# Altium schematic sheet PROC054D_System_LED.SchDoc: SYSTEM_LED
size 558 x 431 mm; Date: Not shown in title block; ApprovedBy: Not shown in title block; CheckedBy: Not shown in title block; Author: Not shown in title block; CompanyName: Not shown in title block; DrawnBy: a0271760; Engineer: Not shown in title block; Organization: Not shown in title block; Address1: Not shown in title block; Address2: Not shown in title block; Address3: Not shown in title block; Address4: Not shown in title block; DocumentNumber: 17; Revision: Use project pAWRameter SCH_Rev; SheetNumber: 17; SheetTotal: 19; PageSetup: Record=PageOptions|CenterHorizontal=True|CenterVertical=True|PrintScale=1.00|XCorrection=1.00|YCorrection=1.00|PrintKind=0|BorderSize=5000000|LeftOffset=0|BottomOffset=0|Orientation=2|PaperLength=1000|PaperWidth=1000|Scale=100|PaperSource=15|PrintQuality=600|MediaType=1|DitherType=10|PaperKind=Letter|PrintScaleMode=1; CurrentTime: Not shown in title block; CurrentDate: Not shown in title block; Time: Not shown in title block; DocumentFullPathAndName: Not shown in title block; DocumentName: Not shown in title block; ModifiedDate: Not shown in title block; ImagePath: Not shown in title block
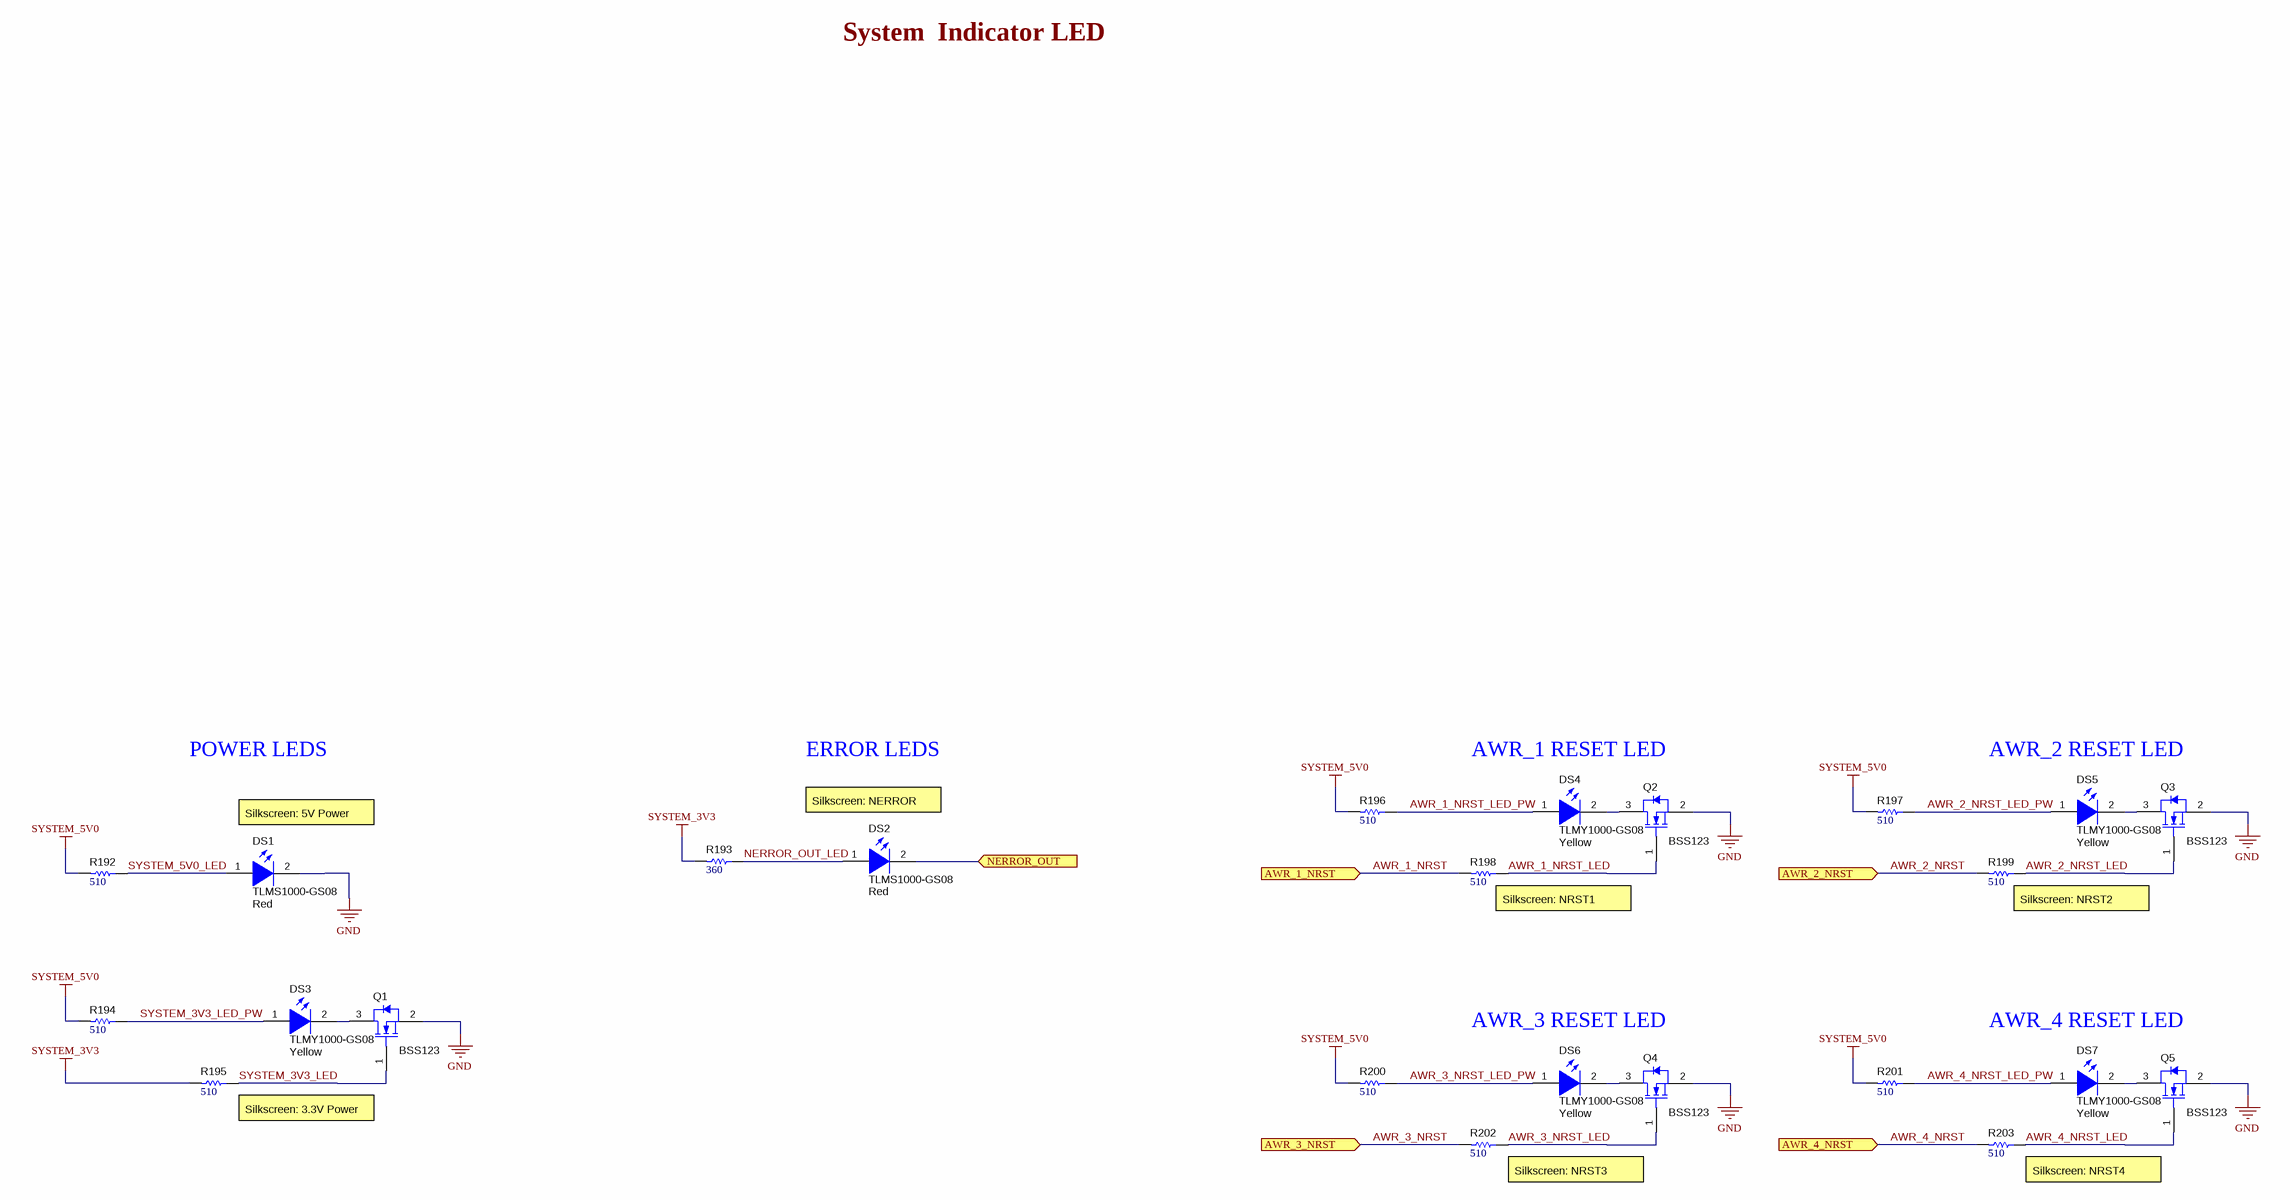
[diagram p0: PROC054D_System_LED.SchDoc]

## Parts
DS1  TLMS1000-GS08  value Red  [TLMx1000_Red]
DS2  TLMS1000-GS08  value Red  [TLMx1000_Red]
DS3  TLMY1000-GS08  value Yellow  [TLMx1000_Yellow]
DS4  TLMY1000-GS08  value Yellow  [TLMx1000_Yellow]
DS5  TLMY1000-GS08  value Yellow  [TLMx1000_Yellow]
DS6  TLMY1000-GS08  value Yellow  [TLMx1000_Yellow]
DS7  TLMY1000-GS08  value Yellow  [TLMx1000_Yellow]
Q1  BSS123  [SOT-23]
Q2  BSS123  [SOT-23]
Q3  BSS123  [SOT-23]
Q4  BSS123  [SOT-23]
Q5  BSS123  [SOT-23]
R192  ValueDisplayed: 510  [0402]  (hidden comment: ERJ-2GEJ511X)
R193  ValueDisplayed: 360  [0402]  (hidden comment: ERJ-2GEJ361X)
R194  ValueDisplayed: 510  [0402]  (hidden comment: ERJ-2GEJ511X)
R195  ValueDisplayed: 510  [0402]  (hidden comment: ERJ-2GEJ511X)
R196  ValueDisplayed: 510  [0402]  (hidden comment: ERJ-2GEJ511X)
R197  ValueDisplayed: 510  [0402]  (hidden comment: ERJ-2GEJ511X)
R198  ValueDisplayed: 510  [0402]  (hidden comment: ERJ-2GEJ511X)
R199  ValueDisplayed: 510  [0402]  (hidden comment: ERJ-2GEJ511X)
R200  ValueDisplayed: 510  [0402]  (hidden comment: ERJ-2GEJ511X)
R201  ValueDisplayed: 510  [0402]  (hidden comment: ERJ-2GEJ511X)
R202  ValueDisplayed: 510  [0402]  (hidden comment: ERJ-2GEJ511X)
R203  ValueDisplayed: 510  [0402]  (hidden comment: ERJ-2GEJ511X)

## Ports
AWR_1_NRST (in), AWR_2_NRST (in), AWR_3_NRST (in), AWR_4_NRST (in), NERROR_OUT (in)

## Nets
GND: DS1.2(K) Q1.2(S) Q2.2(S) Q3.2(S) Q4.2(S) Q5.2(S)
SYSTEM_3V3: R193.2 R195.2
SYSTEM_5V0: R192.2 R194.2 R196.2 R197.2 R200.2 R201.2
AWR_1_NRST: R198.2 ; port AWR_1_NRST
AWR_1_NRST_LED: Q2.1(G) R198.1
AWR_1_NRST_LED_PW: DS4.1(A) R196.1
AWR_2_NRST: R199.2 ; port AWR_2_NRST
AWR_2_NRST_LED: Q3.1(G) R199.1
AWR_2_NRST_LED_PW: DS5.1(A) R197.1
AWR_3_NRST: R202.2 ; port AWR_3_NRST
AWR_3_NRST_LED: Q4.1(G) R202.1
AWR_3_NRST_LED_PW: DS6.1(A) R200.1
AWR_4_NRST: R203.2 ; port AWR_4_NRST
AWR_4_NRST_LED: Q5.1(G) R203.1
AWR_4_NRST_LED_PW: DS7.1(A) R201.1
NERROR_OUT: DS2.2(K) ; port NERROR_OUT
NERROR_OUT_LED: DS2.1(A) R193.1
SYSTEM_3V3_LED: Q1.1(G) R195.1
SYSTEM_3V3_LED_PW: DS3.1(A) R194.1
SYSTEM_5V0_LED: DS1.1(A) R192.1
NetDS3_2: DS3.2(K) Q1.3(D)
NetDS4_2: DS4.2(K) Q2.3(D)
NetDS5_2: DS5.2(K) Q3.3(D)
NetDS6_2: DS6.2(K) Q4.3(D)
NetDS7_2: DS7.2(K) Q5.3(D)

## Notes on the sheet
- System  Indicator LED
- POWER LEDS
- ERROR LEDS
- AWR_1 RESET LED
- AWR_2 RESET LED
- Silkscreen: 5V Power
- Silkscreen: NERROR
- (near R198) Silkscreen: NRST1
- (near R199) Silkscreen: NRST2
- AWR_3 RESET LED
- AWR_4 RESET LED
- (near R195) Silkscreen: 3.3V Power
- (near R202) Silkscreen: NRST3
- (near R203) Silkscreen: NRST4
- Drawn By:
- SVN Rev:
- Number:
- TID #:
- Orderable:
- Rev:
- Sheet Title:
- File:
- Project Title:
- Designed for:
- Assembly VAWRiant:
- Mod. Date:
- Sheet:
- Size:
- of
- C
- http://www.ti.com
- Texas Instruments and/or its licensors do not wAWRrant the accuracy or completeness of this specification or any information contained therein. Texas Instruments and/or its licensors do not wAWRrant that this design will meet the specifications, will be suitable for your application or fit for any pAWRticulAWR purpose, or will operate in an implementation. Texas Instruments and/or its licensors do not wAWRrant that the design is production worthy. You should completely validate and test your design implementation to confirm the system functionality for your application.
- Engineer:
- Contact:
- © Texas Instruments

## Library data of the parts
DS1 DS2 = CMP-0078197-1: LED, Red, SMD; Manufacturer: Vishay-Semiconductor; Tjmax_C: 120°C; SizeAreaWB_mm2: 4.68; Vr_V: 6V; Power_TotalModule: 40mW; Angle: 160; SizeArea_mm2: 1.28; Ir_A: 10µA; SizeZ_mm: 0.65; Io_A: 2mA; Vf_V: 1.8V; SizeY_mm: 0.8; U/M: EA; Value1: .04W; SizeX_mm: 1.6; Type: AlInGaP; ComponentLink1Description: Datasheet link; RoHS: Y; Supplier Part Number 3: 78-TLMS1000; Supplier 1: Digi-Key; PackageReference: 1.6x0.8mm; Color: Red; PartNumber: TLMS1000-GS08; Publisher: Texas Instruments; Supplier Part Number 2: 35M3052; Supplier 2: Newark; Published: 2008-07-11; Value2: 1.8V; ComponentLink1URL: http://www.vishay.com/docs/83172/tlmo1000.pdf; LatestRevisionDate: 2017-10-12; CompType: LED; MountType: SMT; Supplier Part Number 1: TLMS1000-GS08CT-ND; Supplier 3: Mouser
DS3-DS7 = CMP-0078196-1: LED, Yellow, SMD; Manufacturer: Vishay-Semiconductor; Tjmax_C: 120°C; SizeAreaWB_mm2: 4.68; Vr_V: 6V; Power_TotalModule: 40mW; Angle: 160; SizeArea_mm2: 1.28; Ir_A: 10µA; SizeZ_mm: 0.65; Io_A: 2mA; Vf_V: 1.8V; SizeY_mm: 0.8; U/M: EA; Value1: .04W; SizeX_mm: 1.6; Type: AlInGaP; ComponentLink1Description: Datasheet link; RoHS: Y; Supplier Part Number 3: 78-TLMY1000; Supplier 1: Digi-Key; PackageReference: 1.6x0.8mm; Color: yellow; PartNumber: TLMY1000-GS08; Publisher: Texas Instruments; Supplier Part Number 2: 78Y9599; Supplier 2: Newark; Published: 2008-07-11; Value2: 1.8V; ComponentLink1URL: http://www.vishay.com/docs/83172/tlmo1000.pdf; LatestRevisionDate: 2017-10-12; CompType: LED; MountType: SMT; Supplier Part Number 1: TLMY1000-GS08CT-ND; Supplier 3: Mouser
Q1-Q5 = CMP-0000947-2: MOSFET, N-CH, 100 V, 0.17 A, SOT-23; Alternate Manufacturer: None; Manufacturer: Fairchild Semiconductor; SizeZ_mm: 1.1; ChType: N; Value2: 1.8 nC; Value1: 1; VdsMax_V: 100V; SizeX_mm: 2.5; SizeY_mm: 3; Vgs_V: 20V; Value: 100V; Rdson45_ohm: 10; SizeArea_mm2: 7.5; AEC Category: Q101; IdsMax_A: 1.7dA; SizeAreaWB_mm2: 14; U/M: EA; QgTyp_nC: 1.8; Supplier 2: Newark; Supplier 3: Mouser; Supplier 1: Digi-Key; Supplier Part Number 1: BSS123NCT-ND; Supplier Part Number 2: 58K8768; PartNumber: BSS123; ComponentLink1Description: Datasheet link; LatestRevisionDate: 2017-03-09; CompType: MOSFET; PackageReference: SOT-23; LatestRevisionNote: Added parts.; Publisher: Texas Instruments; AEC Qualified: ?; Published: 2008-06-19; Supplier Part Number 3: 512-BSS123; RoHS: Y; MountType: SMT; ComponentLink1URL: http://www.fairchildsemi.com/ds/BS/BSS123.pdf
R192 R194-R203 = CMP-0078212-1: RES, 510, 5%, 0.1 W, AEC-Q200 Grade 0, 0402; Manufacturer: Panasonic; Value_Code: 510R; SizeArea_mm2: 0.5; AEC Qualified: Y; AEC Category: Q200; Value: 510; SizeZ_mm: 0.6; EIA_Code: E24; TempCo: 200 ppm/C; AEC Grade: 0; Power_W: 100mW; VDC_V: 50V; Value2: 0.1W; U/M: EA; SizeX_mm: 1; ComponentLink1Description: Datasheet link; RoHS: Y; Supplier Part Number 3: 667-ERJ-2GEJ511X; Tolerance_%: 5%; Supplier 1: Digi-Key; PackageReference: 0402; Technology: Thick Film; Res_ohm: 510; PartNumber: ERJ-2GEJ511X; Supplier Part Number 2: 65T8293; Supplier 2: Newark; SizeY_mm: 0.5; ComponentLink1URL: https://industrial.panasonic.com/cdbs/www-data/pdf/RDA0000/DMA0000COL9.pdf; Value1: 5%; CompType: Resistor; MountType: SMT; Supplier Part Number 1: P510JCT-ND; Supplier 3: Mouser
R193 = CMP-0078194-1: RES, 360, 5%, 0.1 W, AEC-Q200 Grade 0, 0402; Manufacturer: Panasonic; Value_Code: 360R; SizeArea_mm2: 0.5; AEC Qualified: Y; AEC Category: Q200; Value: 360; SizeZ_mm: 0.6; EIA_Code: E24; TempCo: 200 ppm/C; AEC Grade: 0; Power_W: 100mW; VDC_V: 50V; Value2: 0.1W; U/M: EA; SizeX_mm: 1; ComponentLink1Description: Datasheet link; RoHS: Y; Supplier Part Number 3: 667-ERJ-2GEJ361X; Tolerance_%: 5%; Supplier 1: Digi-Key; PackageReference: 0402; Technology: Thick Film; Res_ohm: 360; PartNumber: ERJ-2GEJ361X; Supplier Part Number 2: 53W4165; Supplier 2: Newark; SizeY_mm: 0.5; ComponentLink1URL: https://industrial.panasonic.com/cdbs/www-data/pdf/RDA0000/DMA0000COL9.pdf; Value1: 5%; CompType: Resistor; MountType: SMT; Supplier Part Number 1: P360JCT-ND; Supplier 3: Mouser